# EAGLE design spinac (EAGLE 6.4)
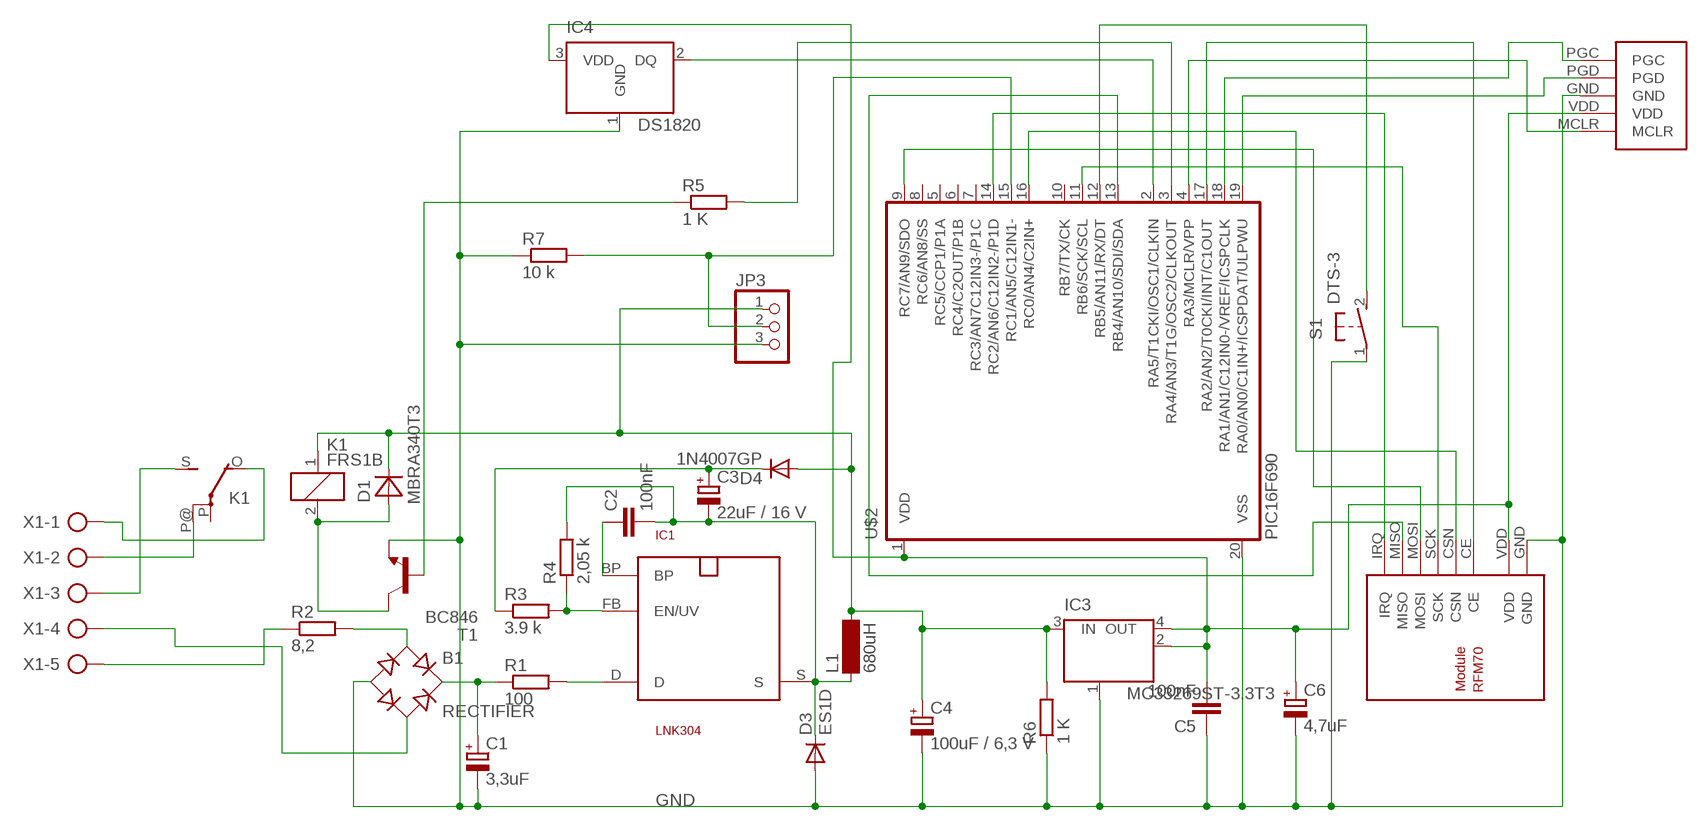
[diagram p0: schematic, sheet 1]

## Parts
B1  RECTIFIER  RECTIFIER-S40  [TO-269AA]
C1  3,3uF  CPOL-EUE5-10.5  [E5-10,5]
C2  100nF  C-EUC2012  [C2012]
C3  22uF / 16 V  CPOL-EUSMCC  [SMC_C]
C4  100uF / 6,3 V  CPOL-EUE2.5-5  [E2,5-5]
C5  100nF  C-EUC2012  [C2012]
C6  4,7uF  CPOL-EUSMCA  [SMC_A]
D1  MBRA340T3  [SMA]
D3  ES1D  DIODE-DO214AC  [DO214AC]
D4  1N4007GP  DIODE-DO214AA  [DO214AA]
IC1  LNK304  SO-8C  [SO-8C]
IC3  MC33269ST-3.3T3  [SOT223]
IC4  DS1820  [TO-92]
JP3  PINHD-1X3  [1X03]
K1  FRS1B  [FRS1B]
L1  680uH  BS11  [BS11]
R1  100  R-EU_R2512W  [R2512W]
R2  8,2  R-EU_0411/12  [0411/12]
R3  3.9 k  R-EU_M2012  [M2012]
R4  2,05 k  R-EU_M2012  [M2012]
R5  1 K  R-EU_M2012  [M2012]
R6  1 K  R-EU_M2012  [M2012]
R7  10 k  R-EU_M2012  [M2012]
S1  DTS-3  [DTS-3]
T1  BC846  [SOT23]
U$1  RFM70  [RFM70]
U$2  PIC16F690  [SSOP20]
U$3  PROGRAMMINGHEADERDIP  [PROGHEADER]
X1  AK500/5  [AK500/5]

## Nets
GND: B1.- C1.- C4.- C5.1 C6.- D3.A IC3.1(GND/ADJ) IC4.1(GND) JP3.3 R6.1 R7.1 S1.1 T1.2(E) U$1.GND U$2.20(VSS) U$3.GND
N$1: IC1.D R1.2
N$2: B1.+ C1.+ R1.1
N$3: B1.AC1 R2.2
N$4: B1.AC2 X1.4
N$5: S1.2 U$2.12(RB5/AN11/RX/DT)
N$6: IC4.2(DQ) U$2.2(RA5/T1CKI/OSC1/CLKIN)
N$7: K1.P@(2:P) X1.2
N$8: K1.S(2:S) X1.3
N$9: C3.+ D4.C R3.1
N$10: C2.1 IC1.BP
N$11: IC1.FB(EN/UV) R3.2 R4.1
N$12: U$1.MISO U$2.13(RB4/AN10/SDI/SDA)
N$13: C2.2 C3.- D3.C IC1.S L1.1 R4.2
N$14: D1.A K1.2 T1.3(C)
N$15: R5.1 T1.1(B)
N$16: U$1.CE U$2.17(RA2/AN2/T0CKI/INT/C1OUT)
N$18: U$2.19(RA0/AN0/C1IN+/ICSPDAT/ULPWU) U$3.PGD
N$19: U$2.18(RA1/AN1/C12IN0-/VREF/ICSPCLK) U$3.PGC
N$20: U$1.CSN U$2.16(RC0/AN4/C2IN+)
N$21: U$1.IRQ U$2.14(RC2/AN6/C12IN2-/P1D)
N$22: U$1.SCK U$2.11(RB6/SCK/SCL)
N$23: U$1.MOSI U$2.9(RC7/AN9/SDO)
N$24: K1.O(2:O) X1.1
N$25: U$2.4(RA3/MCLR/VPP) U$3.MCLR
N$26: C4.+ D1.C D4.A IC3.3(IN) JP3.1 K1.1 L1.2 R6.2
N$28: C5.2 C6.+ IC3.2(OUT) IC3.4(OUT) IC4.3(VDD) U$1.VDD U$2.1(VDD) U$3.VDD
N$32: JP3.2 R7.2 U$2.15(RC1/AN5/C12IN1-)
N$35: R5.2 U$2.3(RA4/AN3/T1G/OSC2/CLKOUT)
N$36: R2.1 X1.5
Unconnected: K1.P(2:P) U$2.5(RC5/CCP1/P1A) U$2.6(RC4/C2OUT/P1B) U$2.7(RC3/AN7C12IN3-/P1C) U$2.8(RC6/AN8/SS) U$2.10(RB7/TX/CK)

## Library data of the parts
B1 = rectifier:RECTIFIER-: Rectifier
C1 C3 C4 C6 = resistor:CPOL-EU: POLARIZED CAPACITOR, European symbol
C2 C5 = resistor:C-EU: CAPACITOR, European symbol
D1 = diode:MBRA340T3: Surface Mount Schottky Power Rectifier Source: http://www.onsemi.com/pub_link/Collateral/MBRA340T3-D.PDF
D3 D4 = diode:DIODE-: DIODE
IC1 = powerint:SO-8C: 700V MOSFET für Schaltnetz-Trafos. Pin 3 fehlt. SMD
IC3 = linear:MC33269ST*: Adjustable Output Low Dropout Voltage Regulator 800 mA Source: http://www.onsemi.com/pub/Collateral/MC33269-D.PDF
IC4 = ds1820:DS1820: DS1820 - 1-Wire Digital Thermometer
JP3 = pinhead:PINHD-1X3: PIN HEADER
K1 = relay:FRS1B: RELAY 1 x switch, same as V23101-D6-A201, Siemens; OC_FARNELL: unknown; OC_NEWARK: unknown
L1 = inductor-neosid:BS: INDUCTOR nominal inductance, magnetically screened; OC_FARNELL: unknown; OC_NEWARK: unknown
R1-R7 = resistor:R-EU_: RESISTOR, European symbol
S1 = switch-tact:DTS-3
T1 = transistor:BC846: NPN TRANSISTOR
U$1 = rfm70:RFM70: RFM70 2.4 Ghz Funkmodul Autor: Daniel Weber Website: http://projects.web4clans.com Email: daniel.weber@web4clans.com
U$2 = microchip:PIC16F690*: MICROCONTROLLER PIC16F690 18 I/O One 16-bit timer Two 8-bit timer Two comparators Precision internal oscillator-software selectable 8 MHz - 32 KHz SSP w/ I2C Compatible Address mask option EUSART LIN 2.0 Compatible ECCP+ w/ PWM Steering 12 A/D Channels ULPW Enhanced Low Power Timer 1 Timer 1 Gate Synch Latch 4k Program Flash memory 256 bytes SRAM 256 bytes EEPROM
U$3 = rfm70:PROGRAMMINGHEADER
X1 = con-ptr500:AK500/5: CONNECTOR; OC_FARNELL: unknown; OC_NEWARK: unknown

## Board
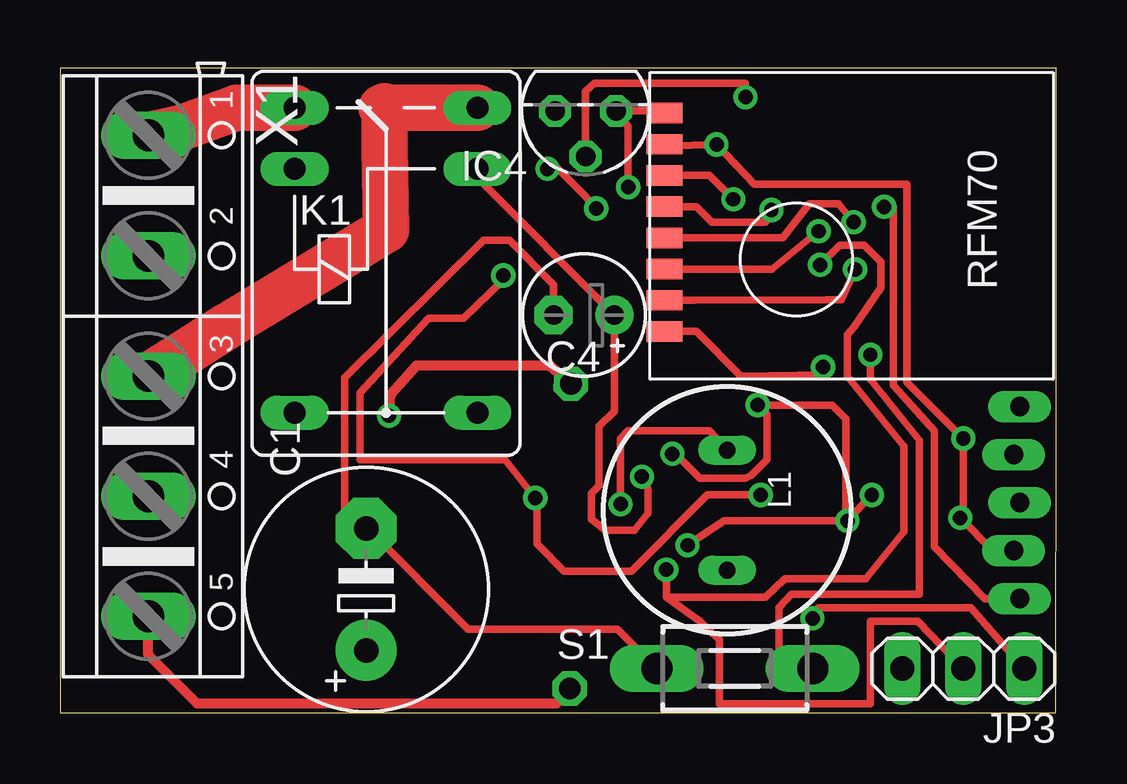
[diagram p1: board, top side]
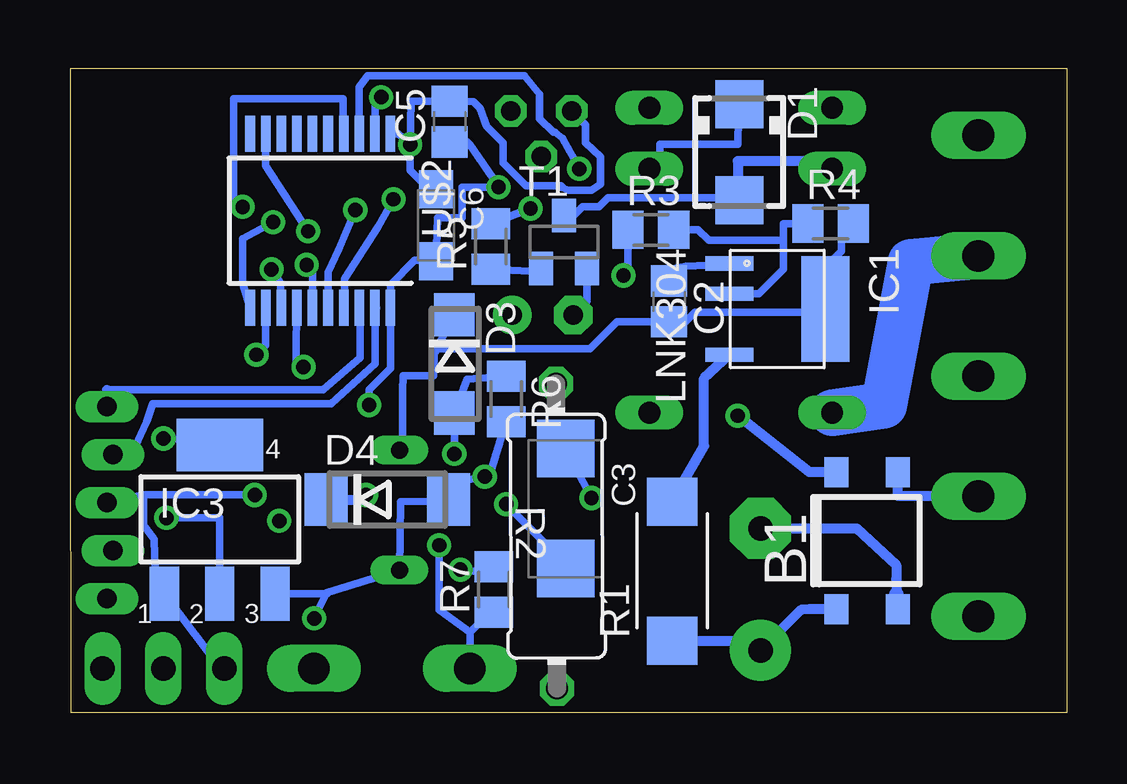
[diagram p2: board, bottom side, seen from below]

Size 41.53 x 26.85 mm. Coordinates in mm from the lower left corner, seen from the top.
Outline: 0,0 41.51,0 41.53,13.46 41.53,26.85 38.52,26.85 0,26.85 0,0
Copper layers (1*16): Top 0.035mm / dielectric 1.5mm / Bottom 0.035mm
Design rules "default": minimum track width 10mil, minimum drill 24mil, track to track 8mil, track to pad 8mil, pad to pad 8mil, via to via 8mil, smd to smd 8mil, copper to edge 40mil, drill to drill 8mil, minimum pad ring 10mil, minimum via ring 8mil, stop-mask expansion 4mil, vias tented up to drill 0mil, thermal gap 10mil

### Footprints (pad centres in the part's own frame; a part is rotated, then mirrored left to right if it is on the bottom)
TO-269AA = smd 1 x 1.25: + -1.28,-2.855; - 1.28,-2.855; AC1 -1.28,2.855; AC2 1.28,2.855
E5-10,5 = drill 1.016 pad 2.54: + -2.54,0 | drill 1.016 pad 2.54 octagon: - 2.54,0
C2012 = smd 1.3 x 1.5: 1 -0.85,0; 2 0.85,0
SMC_C = smd 2.4 x 2.4: + -2.5,0; - 2.5,0
E2,5-5 = drill 0.813 pad 1.6: + -1.27,0 | drill 0.813 pad 1.6 octagon: - 1.27,0
SMC_A = smd 1.6 x 1.4: + -1.5,0; - 1.5,0
SMA = smd 2 x 2: A 2,0; C -2,0
DO214AC = smd 1.8 x 1.7: A 2.05,0; C -2.05,0
DO214AA = smd 1.8 x 2.2: A 2.55,0; C -2.55,0
SO-8C = smd 0.6 x 2: BP -1.905,-2; D 1.905,-2; FB -0.635,-2 | smd 4.41 x 2: S 0,2
SOT223 = smd 1.219 x 2.235: 1 -2.311,-3.099; 2 0,-3.099; 3 2.311,-3.099 | smd 3.6 x 2.2: 4 0,3.099
TO-92 = drill 0.813 pad 1.27 octagon: 1 -1.27,0; 2 0,1.905; 3 1.27,0
1X03 = drill 1.016 long: 1 -2.54,0; 2 0,0; 3 2.54,0
FRS1B = drill 0.914 long: 1 0,3.81; 2 0,-3.81; O -2.54,-3.81; P 10.16,3.81; P@ 10.16,-3.81; S -2.54,3.81
BS11 = drill 0.7 long: 1 -2.5,0; 2 2.5,0
R2512W = smd 2 x 2.1: 1 -2.896,0; 2 2.896,0
0411/12 = drill 0.914 octagon: 1 -6.35,0; 2 6.35,0
M2012 = smd 1.3 x 1.6: 1 -0.95,0; 2 0.95,0
DTS-3 = drill 1.3 long: 1 -3.25,0; 2 3.25,0
SOT23 = smd 1 x 1.4: 1 -0.95,-1.1; 2 0.95,-1.1; 3 0,1.1
RFM70 = smd 0.85 x 1.5: CE 2.5,-14.3; CSN 3.8,-14.3; GND -0.1,-14.3; IRQ 9,-14.3; MISO 7.7,-14.3; MOSI 6.4,-14.3; SCK 5.1,-14.3; VDD 1.2,-14.3
SSOP20 = smd 0.4 x 1.5: 1 -2.925,-3.625; 2 -2.275,-3.625; 3 -1.625,-3.625; 4 -0.975,-3.625; 5 -0.325,-3.625; 6 0.325,-3.625; 7 0.975,-3.625; 8 1.625,-3.625; 9 2.275,-3.625; 10 2.925,-3.625; 11 2.925,3.625; 12 2.275,3.625; 13 1.625,3.625; 14 0.975,3.625; 15 0.325,3.625; 16 -0.325,3.625; 17 -0.975,3.625; 18 -1.625,3.625; 19 -2.275,3.625; 20 -2.925,3.625
PROGHEADER = drill 0.8 long: GND 0,0; MCLR -4,0; PGC 4,0; PGD 2,0.25; VDD -2,0.25
AK500/5 = drill 1.321 long: 1 -10.033,0; 2 -5.004,0; 3 0,0; 4 5.004,0; 5 10.008,0

### Placement (x,y rotation side)
B1  8.32,7.18 0 bottom
C1  12.76,5.14 90 top
C2  16.57,17.14 270 bottom
C3  20.89,8.51 270 bottom
C4  21.84,16.57 180 top
C5  25.72,24.64 90 bottom
C6  26.29,20.32 270 bottom
D1  13.65,23.37 270 bottom
D3  25.53,14.54 270 bottom
D4  28.32,8.89 0 bottom
IC1  12.06,16.83 270 bottom
IC3  35.31,8.06 0 bottom
IC4  21.91,25.08 180 top
JP3  37.66,1.84 180 top
K1  13.59,22.67 270 top
L1  27.81,8.45 270 top
R1  16.45,5.91 90 bottom
R2  21.27,7.37 90.2 bottom
R3  17.34,20.13 0 bottom
R4  9.84,20.38 0 bottom
R5  24,19.43 90 bottom
R6  23.37,13.08 270 bottom
R7  23.88,5.14 90 bottom
S1  28.13,1.85 0 top
T1  20.95,19.62 0 bottom
U$1  39.5,24.89 270 top
U$2  31.11,20.51 180 bottom
U$3  40.01,8.76 90 top
X1  3.68,14.03 270 top

### Tracks (layer width: path | path; a pad name or v marks a point on that pad's centre or on a via)
GND  (via drill 0.6)
  Top 0.305: v26.16,6.99 27.69,8 v32.83,8 | U$1.GND 25.11,25.08 IC4.1 23.69,24.45 v23.69,21.91 | v32.83,8 v33.85,9.08 | v32.83,8 32.77,8.06 32.77,12.26 32.19,12.83 v29.08,12.83 29.46,12.45 29.46,10.54 28.83,9.91 28.57,9.78 26.67,9.78 25.53,10.92 v25.53,10.79 | 12.95,7.49 C1.- | C4.- 20.57,17.84 18.73,19.68 17.65,19.68 11.87,13.97 11.87,8.51 C1.- | C1.- 12.83,7.68 17.02,3.49 23.24,3.49 S1.1
  Bottom 0.305: 25.71,12.55 25.78,12.51 | S1.1 24.88,3.35 | JP3.3 35.69,1.84 35.69,2.4 IC3.1 38,5.87 38.04,7.24 38.48,7.81 38.48,9.08 | v33.85,9.08 38.48,9.08 | 38.48,9.08 U$3.GND | 24.88,3.35 26.16,4.31 v26.16,6.99 | 25.78,23.72 C5.1 24.99,23.79 24.89,23.69 23.72,22.01 v23.69,21.91 25.21,21.91 25.21,20.64 26.23,20.64 C6.- 25.82,18.86 27.18,18.86 28.19,17.85 U$2.20 28.19,14.36 29.08,13.46 v29.08,12.83 | 25.71,12.55 25.65,12.49 D3.A 25,13.9 R6.1 | R7.1 24.04,4.19 24.88,3.35 | T1.2 20,17.14 C4.- | 25.71,12.55 25.53,12.55 v25.53,10.79
  Bottom 0.406: C1.- 8.76,7.68 7.11,6.16 7.11,5.59 7.1,4.94
  Bottom 0.61: B1.- 7.1,4.94
N$1
  Bottom 0.406: R1.2 15.11,11.11 15.11,13.94 IC1.D
N$2
  Bottom 0.406: B1.+ 10.72,4.32 11.07,4.29 C1.+ 13.17,3.01 R1.1
N$3  (via drill 0.6)
  Top 0.406: v13.72,12.38 13.78,13.27 14.86,14.48 20.41,14.48 R2.2
  Bottom 0.406: B1.AC1 10.73,10.03 v13.72,12.38
N$4
  Bottom 0.406: X1.4 7.04,9.03 B1.AC2
N$5  (via drill 0.6)
  Top 0.305: v33.78,14.92 33.78,13.91 35.81,11.37 35.81,4.95 30.48,4.95 29.97,4.38 29.97,3.43 29.98,1.89 S1.2
  Bottom 0.305: U$2.12 33.39,15.31 v33.78,14.92
N$6  (via drill 0.6)
  Top 0.305: IC4.2 21.91,25.91 22.29,26.23 28.57,26.23 v28.57,25.65
  Bottom 0.305: v28.57,25.65 28.83,25.59 U$2.2
N$7
  Bottom 1.93: X1.2 6.49,18.78 7.49,13.46 7.62,12.83 K1.P@
N$8
  Top 1.93: X1.3 6.99,16.13 13.59,20.13 13.53,23.56 13.53,25.21 | 13.53,25.27 13.53,25.21 | 13.53,25.21 13.4,25.21 | 13.53,25.21 K1.S
N$9  (via drill 0.6)
  Top 0.305: v18.48,18.22 18.48,18.03 16.83,16.45 15.37,16.45 12.51,13.34 12.51,10.54 18.54,10.54 v19.81,8.95 19.88,8.89 19.88,7.05 21.02,5.91 23.81,5.91 26.99,9.08 v29.21,9.08
  Bottom 0.305: 21.17,10.73 C3.+ v19.81,8.95 | R3.1 18.29,18.42 v18.48,18.22
  Bottom 0.406: D4.C 29.34,8.89 v29.21,9.08
N$10
  Bottom 0.305: IC1.BP 14.13,18.7 15.88,18.61 16.55,18.48 C2.1
N$11
  Bottom 0.305: IC1.FB 12.83,17.46 11.81,18.48 11.81,19.68 | 11.81,19.68 11.81,20.38 R4.1 | R3.2 15.37,20.13 14.92,19.68 11.81,19.68
N$12  (via drill 0.6)
  Top 0.305: U$1.MISO 26.43,17.19 31.94,17.21 32.58,17.21 v33.15,18.48
  Bottom 0.305: U$2.13 32.77,16.91 32.77,17.91 v33.15,18.48
N$13  (via drill 0.6)
  Top 0.305: v23.37,8.7 23.37,11.43 23.69,11.75 27.07,11.75 L1.1
  Bottom 0.305: D3.C 26.38,14.99 | 26.38,14.99 26.4,14.05 27.67,14.05 27.69,13.4 27.69,11.05 L1.1 | IC1.S 10.06,18.57 9.4,19.24 9.4,20.57 R4.2 | 10.06,16.76 IC1.S | IC1.S 10.34,16.55 10.79,16.7 15.49,16.7 15.9,16.3 C2.2 18.76,16.3 19.88,15.18 26.2,15.18 26.38,14.99 | C3.- 20.89,6.22 v23.37,8.7
N$14
  Bottom 0.305: 13.72,21.14 13.72,21.46 19.11,21.46 19.49,21.08 20.19,21.08 20.64,20.64 T1.3
  Bottom 0.406: K1.2 10.03,22.99 13.72,22.99 13.72,21.14 D1.A
N$15
  Bottom 0.305: R5.1 21.91,18.37 T1.1
N$16  (via drill 0.6)
  Top 0.305: U$1.CE 27.07,22.39 v28.07,21.4
  Bottom 0.305: v28.07,21.4 28.7,20.26 30.1,18.1 30.1,16.93 U$2.17
N$18
  Bottom 0.305: 38.96,10.83 38.35,12.13 38.1,12.89 30.67,12.89 28.83,14.54 28.83,16.88
  Bottom 0.406: U$3.PGD 38.96,10.83 | 28.83,16.88 U$2.19
N$19
  Bottom 0.305: 40.01,13.46 37.34,13.46 30.99,13.46 29.46,14.8 29.46,16.85 U$2.18
  Bottom 0.406: U$3.PGC 40.01,13.46
N$20  (via drill 0.6)
  Top 0.305: U$1.CSN 26.53,21.09 27.18,20.45 29.4,20.45 29.4,20.83 v29.65,20.95
  Bottom 0.305: v29.65,20.95 30.35,19.3 30.8,18.35 U$2.16
N$21  (via drill 0.6)
  Top 0.305: U$1.IRQ 26.53,15.89 28.38,14.03 31.88,14.1 v31.81,14.41
  Bottom 0.305: v31.81,14.41 32.13,14.61 32.13,15.75 32.07,16.86 U$2.14
N$22  (via drill 0.6)
  Top 0.305: U$1.SCK 30.14,19.79 31.24,21.21 32.45,21.21 v33.08,20.45
  Bottom 0.305: v33.08,20.45 34.35,19.75 34.35,17.91 U$2.11
N$23  (via drill 0.6)
  Top 0.305: U$1.MOSI 29.67,18.49 v31.62,20.07
  Bottom 0.305: v31.62,20.07 33.4,22.8 33.4,24.08 U$2.9
N$24
  Top 1.93: X1.1 5.08,24.38 7.37,25.21 K1.O
N$25  (via drill 0.6)
  Top 0.305: U$3.MCLR 38.54,4.76 36.45,6.92 36.45,11.75 34.73,13.65 34.73,21.08 v34.35,21.08
  Bottom 0.305: U$2.4 30.16,24.03 30.16,25.59 34.73,25.59 34.73,21.4 v34.35,21.08
N$26  (via drill 0.6)
  Top 0.305: JP3.1 37.97,4.38 31.62,4.38 v31.37,3.94 | K1.1 17.4,22.29 C4.+ 23.11,12.57 22.48,11.94 22.48,9.46 22.16,9.14 22.16,8.06 22.73,7.62 23.94,7.62 24.51,8.32 24.51,9.34 v24.26,9.84
  Bottom 0.305: K1.1 16.95,23.05 16.95,23.69 13.72,23.69 13.72,24.04 D1.C | IC3.3 30.82,4.97 30.85,5 | 30.85,5 L1.2 27.77,8.8 25.91,8.83 D4.A 24.95,9.72 v24.26,9.84 24,10.1 R6.2 | v31.37,3.94 30.85,5
N$28  (via drill 0.6)
  Top 0.305: U$1.VDD 25.84,23.62 v27.37,23.69 28.96,22.04 35.31,22.04 35.31,13.78 v37.66,11.43 37.66,8.26 v37.53,8.13 38.89,6.76 U$3.VDD
  Bottom 0.305: v27.37,23.69 27.33,25.49 C5.2 24.73,25.46 24.45,25.18 24.19,24.45 23.5,23.75 23.5,22.92 22.54,21.97 21.08,21.97 21.02,21.91 21.08,21.91 20.77,21.78 19.81,21.78 19.43,22.04 19.43,23.18 20.07,23.75 20.07,24.51 IC4.3 | v27.37,23.69 27.88,24.14 U$2.1 | IC3.2 35.31,8.13 v37.53,8.13 | 33.97,10.99 34.35,11.18 35.19,11.18 IC3.4 35.83,11.16 36.03,11.37 v37.66,11.43 | C6.+ 26.58,21.82 27.37,22.61 v27.37,23.69
N$32  (via drill 0.6)
  Top 0.305: JP3.2 36.26,3.3 35.75,3.81 33.78,3.81 33.78,0.38 27.5,0.38 27.5,3.05 26.67,3.81 25.27,4.83 | 25.27,4.83 29.4,4.83 30.23,5.59 33.59,5.59 35.18,7.56 35.18,11.11 32.83,14.03 32.83,15.75 33.08,16.07 34.23,17.72 34.23,18.8 33.53,19.49 32.51,19.49 v31.69,18.67 | 25.27,4.83 v25.27,5.97
  Bottom 0.305: U$2.15 31.43,16.88 31.43,18.29 v31.69,18.67 | R7.2 24.7,5.9 v25.27,5.97
N$35  (via drill 0.6)
  Top 0.305: v20.32,22.67 20.77,22.67 21.84,21.59 v22.35,21.02
  Bottom 0.305: U$2.3 29.49,26.07 29.15,26.54 22.61,26.54 21.97,25.78 21.97,24.77 21.4,24.19 21.34,24.19 21.02,23.94 v20.32,22.67 | R5.2 v22.35,21.02
N$36
  Top 0.406: R2.1 21.25,0.93 20.7,0.38 5.71,0.38 3.68,2.41 X1.5